# Altium schematic sheet POWER.SchDoc
size A4
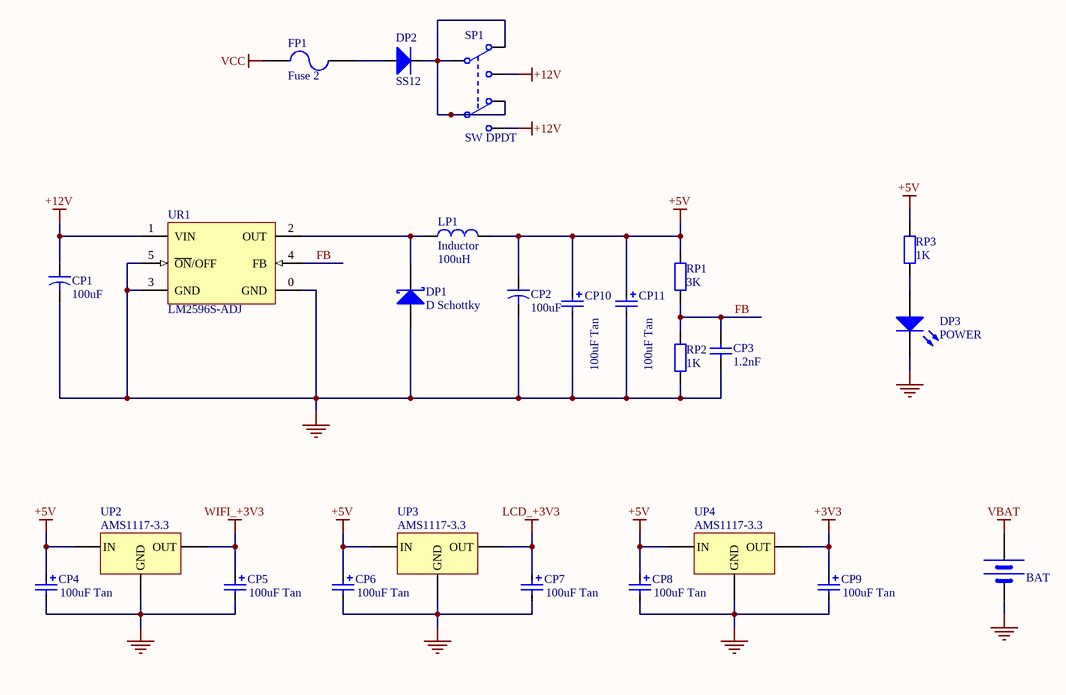
[diagram p0: POWER.SchDoc]

## Parts
BAT  BATT  [BATM]  (value not drawn)
CP1  value 100uF  [SMD-EC-F10]  (hidden comment: Cap3)
CP2  value 100uF  [SMD-EC-F10]  (hidden comment: Cap3)
CP3  value 1.2nF  [CAPC1608N]  (hidden comment: Cap1)
CP4  value 100uF Tan  [CAP_TAN_B_3518]  (hidden comment: Cap_Tan)
CP5  value 100uF Tan  [CAP_TAN_B_3518]  (hidden comment: Cap_Tan)
CP6  value 100uF Tan  [CAP_TAN_B_3518]  (hidden comment: Cap_Tan)
CP7  value 100uF Tan  [CAP_TAN_B_3518]  (hidden comment: Cap_Tan)
CP8  value 100uF Tan  [CAP_TAN_B_3518]  (hidden comment: Cap_Tan)
CP9  value 100uF Tan  [CAP_TAN_B_3518]  (hidden comment: Cap_Tan)
CP10  value 100uF Tan  [CAP_TAN_B_3518]  (hidden comment: Cap_Tan)
CP11  value 100uF Tan  [CAP_TAN_B_3518]  (hidden comment: Cap_Tan)
DP1  D Schottky  [DO-214AC]
DP2  SMA: SS12  [DO-214AC]  (hidden comment: Diode)
DP3  POWER  [CD2012-0805]
FP1  Fuse 2  [1812]
LP1  Inductor  value 100uH  [贴片680u]
RP1  value 3K  [RESC1608N]  (hidden comment: Res1)
RP2  value 1K  [RESC1608N]  (hidden comment: Res1)
RP3  value 1K  [RESC1608N]  (hidden comment: Res1)
SP1  SW DPDT  [DPDT-6 x 2.0]
UP2  AMS1117-3.3  [SOT-223_N]
UP3  AMS1117-3.3  [SOT-223_N]
UP4  AMS1117-3.3  [SOT-223_N]
UR1  LM2596S-ADJ  [TO-263]

## Nets
+3V3: CP9.1 UP4.2(OUT)
+5V: CP2.1 CP4.1 CP6.1 CP8.1 CP10.1 CP11.1 LP1.2 RP1.2 RP3.1 UP2.3(IN) UP3.3(IN) UP4.3(IN)
+12V: CP1.1 SP1.1 SP1.6 UR1.1(VIN)
GND: BAT.2(GND) CP1.2 CP2.2 CP3.1 CP4.2 CP5.2 CP6.2 CP7.2 CP8.2 CP9.2 CP10.2 CP11.2 DP1.1(A) DP3.2(K) RP2.2 UP2.1(GND) UP3.1(GND) UP4.1(GND) UR1.0(GND) UR1.3(GND) UR1.5(~{ON}/OFF)
LCD_+3V3: CP7.1 UP3.2(OUT)
VBAT: BAT.1(VCC)
VCC: FP1.1
WIFI_+3V3: CP5.1 UP2.2(OUT)
FB: CP3.2 RP1.1 RP2.1 UR1.4(FB)
NetDP1_2: DP1.2(K) LP1.1 UR1.2(OUT)
NetDP2_1: DP2.1(A) FP1.2
NetDP2_2: DP2.2(K) SP1.2 SP1.3 SP1.4 SP1.5
NetDP3_1: DP3.1(A) RP3.2

## Library data of the parts
BAT = BAT
CP1 CP2 = Cap3: Capacitor; Published: 23-Sep-2002; PackageReference: CAPR5-4X5; Publisher: Altium Limited
CP3 = Cap1: Capacitor; Published: 8-Jun-2000; LatestRevisionDate: 17-Jul-2002; LatestRevisionNote: Re-released for DXP Platform.; PackageReference: RAD-0.3; Publisher: Altium Limited
CP4-CP11 = Cap_Tan: Capacitor
DP1 = D Schottky: Schottky Diode; Published: 8-Jun-2000; LatestRevisionDate: 17-Jul-2002; LatestRevisionNote: Re-released for DXP Platform.; PackageReference: SMB; Publisher: Altium Limited; Code_JEDEC: DO-214-AA
DP3 = LED2: Typical RED, GREEN, YELLOW, AMBER GaAs LED; Published: 8-Jun-2000; LatestRevisionDate: 17-Jul-2002; LatestRevisionNote: Re-released for DXP Platform.; PackageVersion: Feb-2002; PackageReference: 3.2X1.6X1.1; Publisher: Altium Limited; PackageDescription: SM LED; 2 Flat Leads
FP1 = Fuse 2: Fuse; Published: 8-Jun-2000; LatestRevisionDate: 17-Jul-2002; LatestRevisionNote: Re-released for DXP Platform.; PackageReference: PIN-W2/E2.8; Publisher: Altium Limited; PackageDescription: Thru-Hole; 2 Leads
LP1 = Inductor: Code_IEC: 1005; Published: 8-Jun-2000; LatestRevisionDate: 29-May-2009; LatestRevisionNote: IPC-7351 Footprint Added.; PackageReference: 0402-A; Publisher: Altium Limited; PackageDescription: Chip Inductor; Code_JEITA: 0402
RP1-RP3 = Res1: Resistor; Published: 8-Jun-2000; LatestRevisionDate: 17-Jul-2002; LatestRevisionNote: Re-released for DXP Platform.; PackageReference: AXIAL-0.4; Publisher: Altium Limited
SP1 = SW DPDT: Switch; Published: 24-Mar-1999; LatestRevisionDate: 29-May-2009; LatestRevisionNote: IPC-7351 Footprint Added.; PackageVersion: Mar-2001; PackageReference: SOT23-6; Publisher: Altium Limited; PackageDescription: 6-Pin SOT-23 Package 0.95 mm Pitch, 2.7 mm Lead Span; Code_JEITA: SC-74; Code_IPC: SOT26A-6
UR1 = LM2575T-ADJ: SIMPLE SWITCHER 1A Step-Down Voltage Regulator; Manufacturer: National Semiconductor; PackageTopMarking: NSUZXYTT*LM2575T*-ADJ P+; PowerWise: N; FirstPublished: 4-Dec-2008; DatasheetVersion: Apr-2007; PackageVersion: revJ, Jan-1992; PackageReference: T05A; Publisher: Altium Limited; PackageDescription: TO-220, Molded, 5 Lead, Straight; CompType: Switcher; PartNumber: LM2575T-ADJ; RoHS: O; PinCount: 5; DigiKeyPartNumber: LM2575T-ADJNS-ND; Code_JEDEC: TO-220-AB; ComponentLink1Description: LM2575 Datasheet; ComponentLink1URL: http://www.national.com/ds/LM/LM2575.pdf; ComponentLink2Description: LM2575 Web Page; ComponentLink2URL: http://www.national.com/pf/LM/LM2575.html; ComponentLink3Description: T05A Package Page; ComponentLink3URL: http://www.national.com/packaging/folders/t05a.html